# Altium schematic sheet top-level-simplified.SchDoc
size A4; SheetNumber: 13; SheetTotal: 13
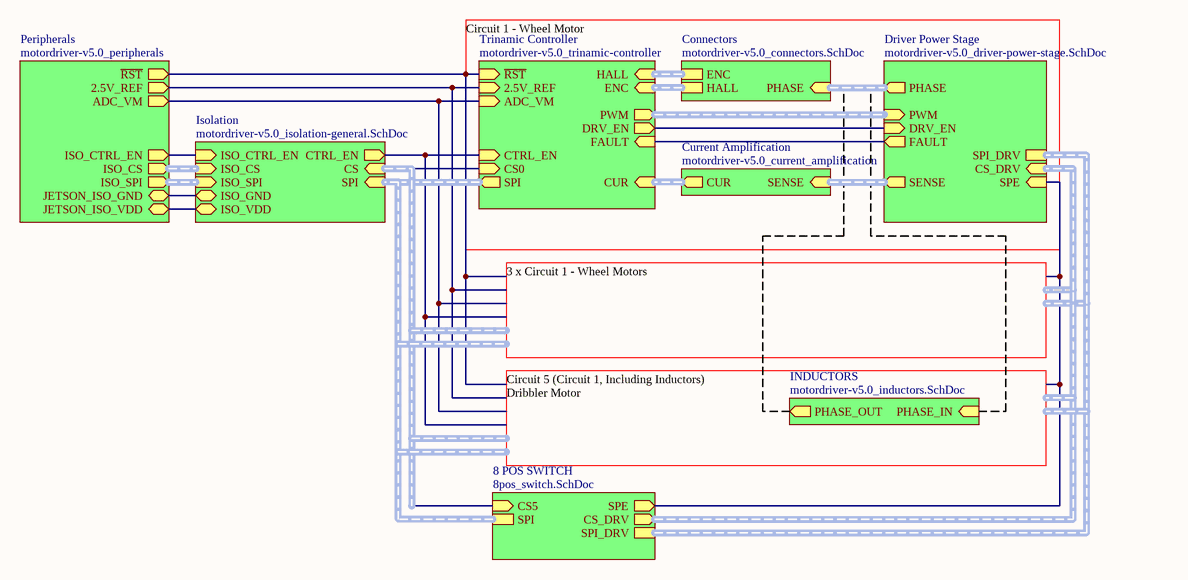
[diagram p0: top-level-simplified.SchDoc]

## Sub-sheets
8 POS SWITCH = 8pos_switch.SchDoc: CS5 (in), SPI, CS_DRV (out), SPI_DRV, SPE (out)
Connectors = motordriver-v5.0_connectors.SchDoc: PHASE (in), ENC, HALL
Current Amplification = motordriver-v5.0_current_amplification: SENSE (in), CUR (out)
Driver Power Stage = motordriver-v5.0_driver-power-stage.SchDoc: DRV_EN (in), PWM (in), FAULT (out), SENSE (out), PHASE (out), SPE (in), CS_DRV (in), SPI_DRV
INDUCTORS = motordriver-v5.0_inductors.SchDoc: PHASE_IN (in), PHASE_OUT (out)
Isolation = motordriver-v5.0_isolation-general.SchDoc: ISO_SPI (in), ISO_CS (in), ISO_GND (bidir), ISO_VDD (bidir), SPI (in), CS (in), ISO_CTRL_EN (in), CTRL_EN (out)
Peripherals = motordriver-v5.0_peripherals: ~{RST} (out), ADC_VM (out), ISO_CTRL_EN (out), JETSON_ISO_VDD (bidir), JETSON_ISO_GND (bidir), ISO_CS (out), 2.5V_REF (out), ISO_SPI (out)
Trinamic Controller = motordriver-v5.0_trinamic-controller: ~{RST} (in), CUR (in), DRV_EN (out), ADC_VM (in), CTRL_EN (in), PWM (out), HALL (in), ENC (in), 2.5V_REF (in), FAULT (in), SPI (out), CS0 (in)

## Nets
(unnamed): sheet Peripherals/~{RST}, sheet Trinamic Controller/~{RST}
(unnamed): sheet Peripherals/ADC_VM, sheet Trinamic Controller/ADC_VM
(unnamed): sheet Peripherals/ISO_CTRL_EN, sheet Isolation/ISO_CTRL_EN
(unnamed): sheet Peripherals/JETSON_ISO_VDD, sheet Isolation/ISO_VDD
(unnamed): sheet Peripherals/JETSON_ISO_GND, sheet Isolation/ISO_GND
(unnamed): sheet Peripherals/2.5V_REF, sheet Trinamic Controller/2.5V_REF
(unnamed): sheet Driver Power Stage/DRV_EN, sheet Trinamic Controller/DRV_EN
(unnamed): sheet Driver Power Stage/FAULT, sheet Trinamic Controller/FAULT
(unnamed): sheet Driver Power Stage/SPE, sheet 8 POS SWITCH/SPE
(unnamed): sheet Trinamic Controller/CTRL_EN, sheet Isolation/CTRL_EN

## Buses and harness runs
harness sheet 8 POS SWITCH/CS_DRV = sheet Driver Power Stage/CS_DRV
harness sheet 8 POS SWITCH/SPI = sheet Isolation/SPI = sheet Trinamic Controller/SPI
harness sheet 8 POS SWITCH/SPI_DRV = sheet Driver Power Stage/SPI_DRV
harness sheet Connectors/ENC = sheet Trinamic Controller/HALL
harness sheet Connectors/HALL = sheet Trinamic Controller/ENC
harness sheet Connectors/PHASE = sheet Driver Power Stage/PHASE
harness sheet Current Amplification/CUR = sheet Trinamic Controller/CUR
harness sheet Current Amplification/SENSE = sheet Driver Power Stage/SENSE
harness sheet Driver Power Stage/PWM = sheet Trinamic Controller/PWM
harness sheet Isolation/ISO_CS = sheet Peripherals/ISO_CS
harness sheet Isolation/ISO_SPI = sheet Peripherals/ISO_SPI

## Notes on the sheet
- Circuit 1 - Wheel Motor
- 3 x Circuit 1 - Wheel Motors
- Circuit 5 (Circuit 1, Including Inductors)
  Dribbler Motor